# EAGLE schematic Needler_Rev_1_00 (EAGLE 6.4)
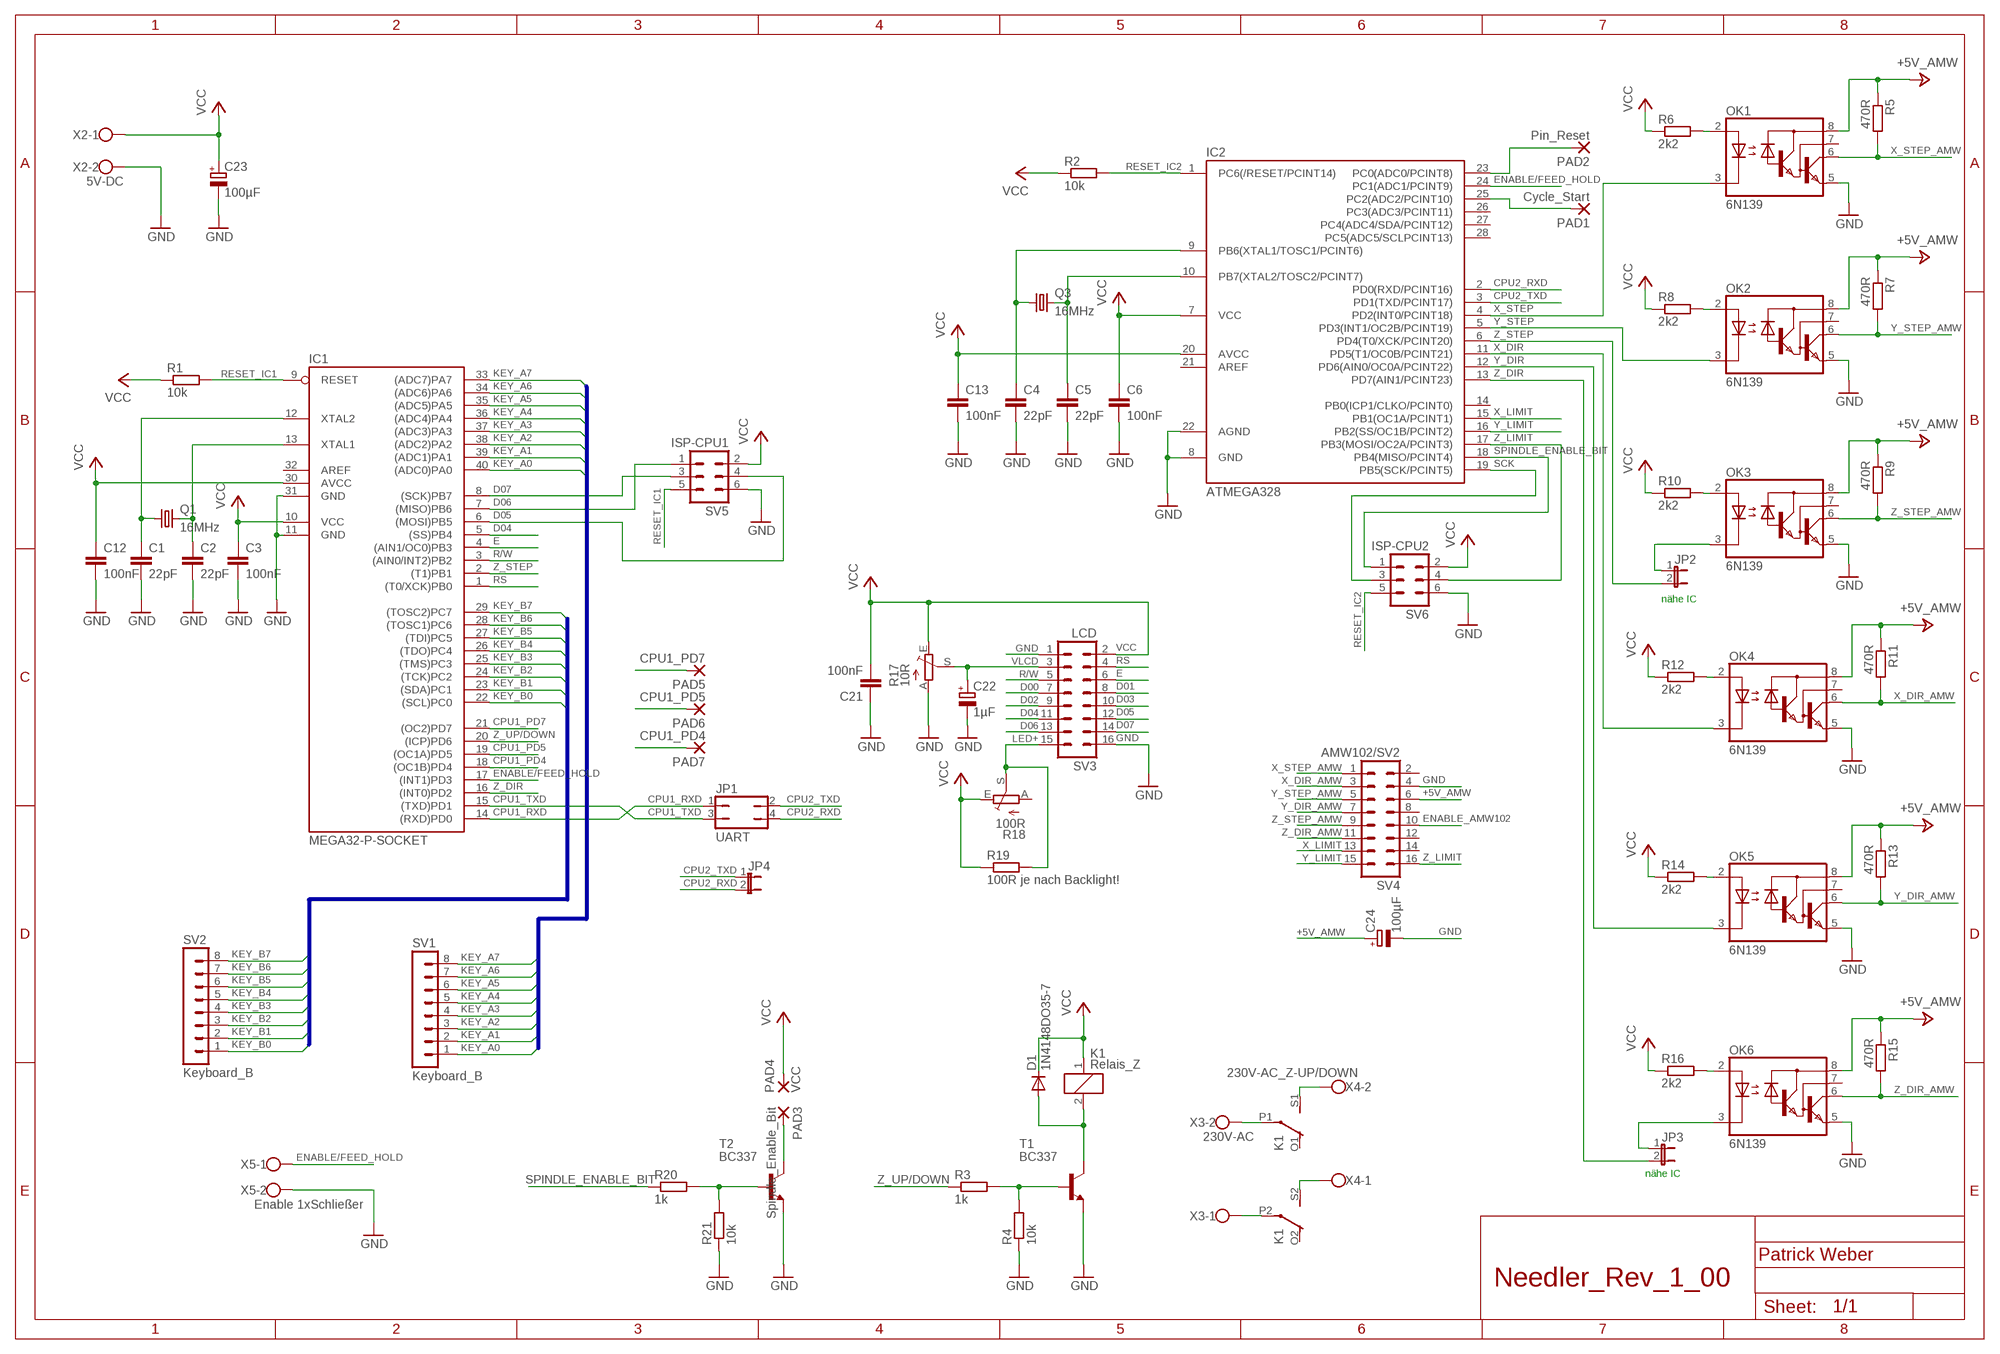
[diagram p0: schematic, sheet 1]

## Parts
C1  22pF  C-EUC1206  [C1206]
C2  22pF  C-EUC1206  [C1206]
C3  100nF  C-EU050-024X044  [C050-024X044]
C4  22pF  C-EUC1206  [C1206]
C5  22pF  C-EUC1206  [C1206]
C6  100nF  C-EU050-024X044  [C050-024X044]
C12  100nF  C-EU050-024X044  [C050-024X044]
C13  100nF  C-EU050-024X044  [C050-024X044]
C21  100nF  C-EU050-024X044  [C050-024X044]
C22  1µF  CPOL-EUE2.5-6  [E2,5-6]
C23  100µF  CPOL-EUE2.5-6  [E2,5-6]
C24  100µF  CPOL-EUE2.5-6  [E2,5-6]
D1  1N4148DO35-7  [DO35-7]
IC1  MEGA32-P-SOCKET  [DIL40-SOCKET]
IC2  ATMEGA328  MEGA48/88/168-PU  [DIL28-3]
JP1  UART  JP2Q  [JP2Q]
JP2  JP1E  [JP1]
JP3  JP1E  [JP1]
JP4  JP1E  [JP1]
K1  Relais_Z  G2R2HF118F  [HF118F]
OK1  6N139  6N138  [SO8-GW300]
OK2  6N139  6N138  [SO8-GW300]
OK3  6N139  6N138  [SO8-GW300]
OK4  6N139  6N138  [SO8-GW300]
OK5  6N139  6N138  [SO8-GW300]
OK6  6N139  6N138  [SO8-GW300]
PAD1  Cycle_Start  WIREPAD  [2,54/1,1-2,54/5,08]
PAD2  Pin_Reset  WIREPAD  [2,54/1,1-2,54/5,08]
PAD3  Spindle_Enable_Bit  WIREPAD  [2,54/1,1-2,54/5,08]
PAD4  VCC  2,54/1,1-1,54/5,08  [2,54/1,1-2,54/5,08]
PAD5  CPU1_PD7  WIREPAD  [2,54/1,1-2,54/5,08]
PAD6  CPU1_PD5  WIREPAD  [2,54/1,1-2,54/5,08]
PAD7  CPU1_PD4  WIREPAD  [2,54/1,1-2,54/5,08]
Q1  16MHz  CRYSTALHC49U-V  [HC49U-V]
Q3  16MHz  CRYSTALHC49U-V  [HC49U-V]
R1  10k  R-EU_0204/7  [0204/7]
R2  10k  R-EU_0204/7  [0204/7]
R3  1k  R-EU_0204/7  [0204/7]
R4  10k  R-EU_0204/7  [0204/7]
R5  470R  R-EU_0204/7  [0204/7]
R6  2k2  R-EU_0204/7  [0204/7]
R7  470R  R-EU_0204/7  [0204/7]
R8  2k2  R-EU_0204/7  [0204/7]
R9  470R  R-EU_0204/7  [0204/7]
R10  2k2  R-EU_0204/7  [0204/7]
R11  470R  R-EU_0204/7  [0204/7]
R12  2k2  R-EU_0204/7  [0204/7]
R13  470R  R-EU_0204/7  [0204/7]
R14  2k2  R-EU_0204/7  [0204/7]
R15  470R  R-EU_0204/7  [0204/7]
R16  2k2  R-EU_0204/7  [0204/7]
R17  10R  TRIM_EU-CA6V  [CA6V]
R18  100R  TRIM_EU-CA6V  [CA6V]
R19  100R je nach Backlight!  R-EU_0204/7  [0204/7]
R20  1k  R-EU_0204/7  [0204/7]
R21  10k  R-EU_0204/7  [0204/7]
SV1  Keyboard_B  MA08-1  [MA08-1]
SV2  Keyboard_B  MA08-1  [MA08-1]
SV3  LCD  ML16  [ML16]
SV4  AMW102/SV2  ML16  [ML16]
SV5  ISP-CPU1  ML6  [ML6]
SV6  ISP-CPU2  ML6  [ML6]
T1  BC337  [TO92]
T2  BC337  [TO92]
X2  5V-DC  W237-102  [W237-102]
X3  230V-AC  W237-102  [W237-102]
X4  230V-AC_Z-UP/DOWN  W237-102  [W237-102]
X5  Enable 1xSchließer  W237-102  [W237-102]

## Nets
+5V_AMW: C24.+ OK1.8(VCC) OK2.8(VCC) OK3.8(VCC) OK4.8(VCC) OK5.8(VCC) OK6.8(VCC) R5.1 R7.1 R9.1 R11.1 R13.1 R15.1 SV4.6
CPU1_PD4: IC1.18((OC1B)PD4) PAD7.1(P)
CPU1_PD5: IC1.19((OC1A)PD5) PAD6.1(P)
CPU1_PD7: IC1.21((OC2)PD7) PAD5.1(P)
CPU1_RXD: IC1.14((RXD)PD0) JP1.1
CPU1_TXD: IC1.15((TXD)PD1) JP1.3
CPU2_RXD: IC2.2(PD0(RXD/PCINT16)) JP1.4 JP4.2
CPU2_TXD: IC2.3(PD1(TXD/PCINT17)) JP1.2 JP4.1
CYCLE_START: IC2.25(PC2(ADC2/PCINT10)) PAD1.1(P)
D00: SV3.7
D01: SV3.8
D02: SV3.9
D03: SV3.10
D04: IC1.5((SS)PB4) SV3.11
D05: IC1.6((MOSI)PB5) SV3.12 SV5.4
D06: IC1.7((MISO)PB6) SV3.13 SV5.1
D07: IC1.8((SCK)PB7) SV3.14 SV5.3
E: IC1.4((AIN1/OC0)PB3) SV3.6
ENABLE/FEED_HOLD: IC1.17((INT1)PD3) IC2.24(PC1(ADC1/PCINT9)) X5.1
ENABLE_AMW102: SV4.10
GND: C1.2 C2.2 C3.2 C4.2 C5.2 C6.2 C12.2 C13.2 C21.1 C22.- C23.- C24.- IC1.11(GND) IC1.31(GND) IC2.8(GND) IC2.22(AGND) OK1.5(GND) OK2.5(GND) OK3.5(GND) OK4.5(GND) OK5.5(GND) OK6.5(GND) R4.1 R17.A R21.1 SV3.1 SV3.16 SV4.4 SV5.6 SV6.6 T1.1(E) T2.1(E) X2.2 X5.2
KEY_A0: IC1.40((ADC0)PA0) SV1.1
KEY_A1: IC1.39((ADC1)PA1) SV1.2
KEY_A2: IC1.38((ADC2)PA2) SV1.3
KEY_A3: IC1.37((ADC3)PA3) SV1.4
KEY_A4: IC1.36((ADC4)PA4) SV1.5
KEY_A5: IC1.35((ADC5)PA5) SV1.6
KEY_A6: IC1.34((ADC6)PA6) SV1.7
KEY_A7: IC1.33((ADC7)PA7) SV1.8
KEY_B0: IC1.22((SCL)PC0) SV2.1
KEY_B1: IC1.23((SDA)PC1) SV2.2
KEY_B2: IC1.24((TCK)PC2) SV2.3
KEY_B3: IC1.25((TMS)PC3) SV2.4
KEY_B4: IC1.26((TDO)PC4) SV2.5
KEY_B5: IC1.27((TDI)PC5) SV2.6
KEY_B6: IC1.28((TOSC1)PC6) SV2.7
KEY_B7: IC1.29((TOSC2)PC7) SV2.8
LED+: R18.S R19.2 SV3.15
N$1: C2.1 IC1.13(XTAL1) Q1.2
N$2: C1.1 IC1.12(XTAL2) Q1.1
N$3: K1.P1(2:P) X3.2
N$4: C5.1 IC2.10(PB7(XTAL2/TOSC2/PCINT7)) Q3.2
N$5: C4.1 IC2.9(PB6(XTAL1/TOSC1/PCINT6)) Q3.1
N$6: K1.S1(2:S) X4.2
N$7: K1.P2(3:P) X3.1
N$8: R3.2 R4.2 T1.2(B)
N$9: D1.A K1.2 T1.3(C)
N$10: OK2.2(A) R8.2
N$11: OK3.2(A) R10.2
N$12: K1.S2(3:S) X4.1
N$13: PAD3.1(P) T2.3(C)
N$14: R20.2 R21.2 T2.2(B)
N$18: OK1.2(A) R6.2
N$21: OK5.2(A) R14.2
N$23: OK6.2(A) R16.2
N$24: JP2.1 OK3.3(C)
N$25: OK4.2(A) R12.2
N$26: JP3.1 OK6.3(C)
PIN_RESET: IC2.23(PC0(ADC0/PCINT8)) PAD2.1(P)
R/W: IC1.3((AIN0/INT2)PB2) SV3.5
RESET_IC1: IC1.9(RESET) R1.2 SV5.5
RESET_IC2: IC2.1(PC6(/RESET/PCINT14)) R2.2 SV6.5
RS: IC1.1((T0/XCK)PB0) SV3.4
SCK: IC2.19(PB5(SCK/PCINT5)) SV6.3
SPINDLE_ENABLE_BIT: IC2.18(PB4(MISO/PCINT4)) R20.1 SV6.1
VCC: C3.1 C6.1 C12.1 C13.1 C21.2 C23.+ D1.C IC1.10(VCC) IC1.30(AVCC) IC2.7(VCC) IC2.20(AVCC) K1.1 PAD4.1(P) R1.1 R2.1 R6.1 R8.1 R10.1 R12.1 R14.1 R16.1 R17.E R18.E R19.1 SV3.2 SV5.2 SV6.2 X2.1
VLCD: C22.+ R17.S SV3.3
X_DIR: IC2.11(PD5(T1/OC0B/PCINT21)) OK4.3(C)
X_DIR_AMW: OK4.6(VO) R11.2 SV4.3
X_LIMIT: IC2.15(PB1(OC1A/PCINT1)) SV4.13
X_STEP: IC2.4(PD2(INT0/PCINT18)) OK1.3(C)
X_STEP_AMW: OK1.6(VO) R5.2 SV4.1
Y_DIR: IC2.12(PD6(AIN0/OC0A/PCINT22)) OK5.3(C)
Y_DIR_AMW: OK5.6(VO) R13.2 SV4.7
Y_LIMIT: IC2.16(PB2(SS/OC1B/PCINT2)) SV4.15
Y_STEP: IC2.5(PD3(INT1/OC2B/PCINT19)) OK2.3(C)
Y_STEP_AMW: OK2.6(VO) R7.2 SV4.5
Z_DIR: IC1.16((INT0)PD2) IC2.13(PD7(AIN1/PCINT23)) JP3.2
Z_DIR_AMW: OK6.6(VO) R15.2 SV4.11
Z_LIMIT: IC2.17(PB3(MOSI/OC2A/PCINT3)) SV4.16 SV6.4
Z_STEP: IC1.2((T1)PB1) IC2.6(PD4(T0/XCK/PCINT20)) JP2.2
Z_STEP_AMW: OK3.6(VO) R9.2 SV4.9
Z_UP/DOWN: IC1.20((ICP)PD6) R3.1
Unconnected: IC1.32(AREF) IC2.14(PB0(ICP1/CLKO/PCINT0)) IC2.21(AREF) IC2.26(PC3(ADC3/PCINT11)) IC2.27(PC4(ADC4/SDA/PCINT12)) IC2.28(PC5(ADC5/SCLPCINT13)) K1.O1(2:O) K1.O2(3:O) OK1.7(VB) OK2.7(VB) OK3.7(VB) OK4.7(VB) OK5.7(VB) OK6.7(VB) R18.A SV4.2 SV4.8 SV4.12 SV4.14

## Buses
KEY_A[0..7]
KEY_B[0..7]

## Notes on the sheet
- nähe IC
- nähe IC
- Patrick Weber

## Library data of the parts
C1-C6 C12 C13 C21 = resistor:C-EU: CAPACITOR, European symbol
C22-C24 = resistor:CPOL-EU: POLARIZED CAPACITOR, European symbol
D1 = diode:1N4148: DIODE high speed (Philips)
IC1 = atmel:MEGA32-P: MICROCONTROLLER 32 Kbytes FLASH 2 Kbytes SRAM 1 Kbytes EEPROM USART 8-channel 10 bit ADC Source: www.atmel.com .. doc2503.pdf
IC2 = avr:MEGA48/88/168-PU
JP1 = jumper:JP2Q: JUMPER
JP2-JP4 = jumper:JP1E: JUMPER
K1 = relay:G2R2: RELAY 2 x switch, Omron
OK1-OK6 = optocoupler_PW:6N138: MOTOROLA OPTO COUPLER
PAD1-PAD3 PAD5-PAD7 = wirepad:WIREPAD: Wire PAD connect wire on PCB
PAD4 = wirepad:2,54/1,1-1,54/5,08
Q1 Q3 = crystal:CRYSTAL: CRYSTAL; OC_FARNELL: 1666969; OC_NEWARK: unknown
R1-R16 R19-R21 = resistor:R-EU_: RESISTOR, European symbol
R17 R18 = pot:TRIM_EU-: POTENTIOMETER
SV1 SV2 = con-lstb:MA08-1: PIN HEADER; OC_FARNELL: unknown; OC_NEWARK: unknown
SV3 SV4 = con-harting-ml:ML16: HARTING; OC_FARNELL: unknown; OC_NEWARK: unknown
SV5 SV6 = con-harting-ml:ML6: HARTING; OC_FARNELL: unknown; OC_NEWARK: unknown
T1 T2 = transistor:BC337: NPN TRANSISTOR
X2-X5 = con-wago-500:W237-102: WAGO SCREW CLAMP; MPN: 237-102; OC_FARNELL: unknown; OC_NEWARK: 70K9898